# Altium project stm32f7board.PrjPcb (part 1 of 3)
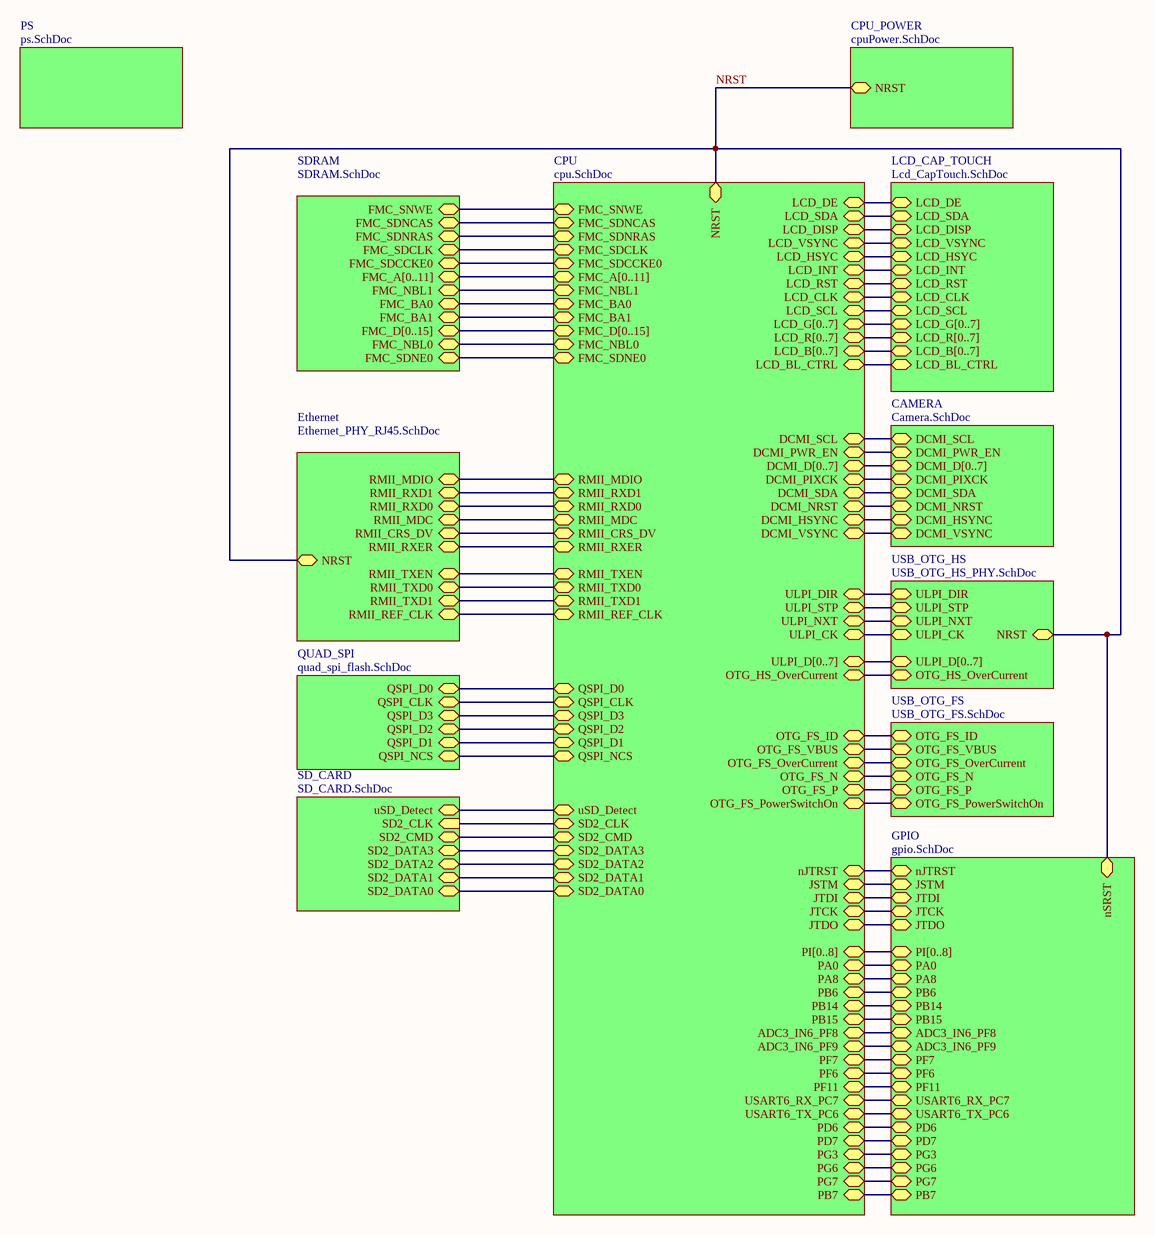
[diagram p0: main.SchDoc]
13 sheets, 223 parts. Net scope: hierarchical (ports join the sheet entries above them; power ports are global).
Board file: stm32f7ng.PcbDoc
Sheets:
  main.SchDoc
    CPU = cpu.SchDoc
    PS = ps.SchDoc
    Ethernet = Ethernet_PHY_RJ45.SchDoc
    SDRAM = SDRAM.SchDoc
    QUAD_SPI = quad_spi_flash.SchDoc
    CPU_POWER = cpuPower.SchDoc
    LCD_CAP_TOUCH = Lcd_CapTouch.SchDoc
    SD_CARD = SD_CARD.SchDoc
    CAMERA = Camera.SchDoc
    USB_OTG_FS = USB_OTG_FS.SchDoc
    USB_OTG_HS = USB_OTG_HS_PHY.SchDoc
    GPIO = gpio.SchDoc

## Sheet main.SchDoc
size B

### Sub-sheets
CAMERA = Camera.SchDoc: DCMI_SCL (bidir), DCMI_PWR_EN (bidir), DCMI_D[0..7] (bidir), DCMI_PIXCK (bidir), DCMI_SDA (bidir), DCMI_NRST (bidir), DCMI_HSYNC (bidir), DCMI_VSYNC (bidir)
CPU = cpu.SchDoc: FMC_SDNRAS (bidir), FMC_SNWE (bidir), FMC_NBL0 (bidir), FMC_SDCCKE0 (bidir), FMC_SDCLK (bidir), FMC_SDNCAS (bidir), FMC_SDNE0 (bidir), FMC_NBL1 (bidir), FMC_BA1 (bidir), FMC_BA0 (bidir), FMC_A[0..11] (bidir), FMC_D[0..15] (bidir), RMII_MDC (bidir), RMII_RXD0 (bidir), RMII_RXER (bidir), RMII_CRS_DV (bidir), RMII_RXD1 (bidir), RMII_MDIO (bidir), RMII_TXEN (bidir), RMII_TXD0 (bidir), RMII_TXD1 (bidir), RMII_REF_CLK (bidir), QSPI_D0 (bidir), QSPI_NCS (bidir), QSPI_D1 (bidir), QSPI_CLK (bidir), QSPI_D3 (bidir), QSPI_D2 (bidir), SD2_CLK (bidir), SD2_CMD (bidir), uSD_Detect (bidir), SD2_DATA3 (bidir), SD2_DATA2 (bidir), SD2_DATA1 (bidir), SD2_DATA0 (bidir), LCD_B[0..7] (bidir), LCD_VSYNC (bidir), LCD_DE (bidir), LCD_R[0..7] (bidir), LCD_G[0..7] (bidir), LCD_DISP (bidir), LCD_RST (bidir), LCD_SCL (bidir), LCD_SDA (bidir), LCD_INT (bidir), LCD_CLK (bidir), LCD_HSYC (bidir), LCD_BL_CTRL (bidir), DCMI_SCL (bidir), DCMI_NRST (bidir), DCMI_PWR_EN (bidir), DCMI_SDA (bidir), DCMI_VSYNC (bidir), DCMI_HSYNC (bidir), DCMI_PIXCK (bidir), DCMI_D[0..7] (bidir), ULPI_CK (bidir), ULPI_NXT (bidir), OTG_HS_OverCurrent (bidir), ULPI_D[0..7] (bidir), ULPI_DIR (bidir), ULPI_STP (bidir), OTG_FS_P (bidir), OTG_FS_VBUS (bidir), OTG_FS_OverCurrent (bidir), OTG_FS_PowerSwitchOn (bidir), OTG_FS_N (bidir), OTG_FS_ID (bidir), NRST (bidir), PA8 (bidir), PF7 (bidir), ADC3_IN6_PF8 (bidir), USART6_RX_PC7 (bidir), USART6_TX_PC6 (bidir), PD6 (bidir), PD7 (bidir), PB14 (bidir), PB15 (bidir), PB6 (bidir), PI[0..8] (bidir), PG3 (bidir), PG6 (bidir), PG7 (bidir), PF6 (bidir), PF11 (bidir), ADC3_IN6_PF9 (bidir), PA0 (bidir), JTCK (bidir), JSTM (bidir), JTDO (bidir), nJTRST (bidir), JTDI (bidir), PB7 (bidir)
CPU_POWER = cpuPower.SchDoc: NRST (bidir)
Ethernet = Ethernet_PHY_RJ45.SchDoc: RMII_MDIO (bidir), RMII_RXD1 (bidir), RMII_RXD0 (bidir), RMII_MDC (bidir), RMII_CRS_DV (bidir), RMII_RXER (bidir), NRST (bidir), RMII_TXEN (bidir), RMII_TXD0 (bidir), RMII_TXD1 (bidir), RMII_REF_CLK (bidir)
GPIO = gpio.SchDoc: PG3 (bidir), PF11 (bidir), USART6_RX_PC7 (bidir), PF6 (bidir), PG7 (bidir), ADC3_IN6_PF8 (bidir), JTDI (bidir), nJTRST (bidir), JSTM (bidir), PD7 (bidir), PB15 (bidir), PF7 (bidir), PB14 (bidir), PI[0..8] (bidir), USART6_TX_PC6 (bidir), PB6 (bidir), JTCK (bidir), PA0 (bidir), PG6 (bidir), PD6 (bidir), ADC3_IN6_PF9 (bidir), JTDO (bidir), PA8 (bidir), nSRST (bidir), PB7 (bidir)
LCD_CAP_TOUCH = Lcd_CapTouch.SchDoc: LCD_B[0..7] (bidir), LCD_DE (bidir), LCD_SDA (bidir), LCD_DISP (bidir), LCD_R[0..7] (bidir), LCD_SCL (bidir), LCD_INT (bidir), LCD_RST (bidir), LCD_HSYC (bidir), LCD_CLK (bidir), LCD_VSYNC (bidir), LCD_G[0..7] (bidir), LCD_BL_CTRL (bidir)
PS = ps.SchDoc: no entries
QUAD_SPI = quad_spi_flash.SchDoc: QSPI_D0 (bidir), QSPI_CLK (bidir), QSPI_D3 (bidir), QSPI_D2 (bidir), QSPI_D1 (bidir), QSPI_NCS (bidir)
SD_CARD = SD_CARD.SchDoc: uSD_Detect (bidir), SD2_CLK (in), SD2_CMD (bidir), SD2_DATA3 (bidir), SD2_DATA2 (bidir), SD2_DATA1 (bidir), SD2_DATA0 (bidir)
SDRAM = SDRAM.SchDoc: FMC_SNWE (bidir), FMC_SDNCAS (bidir), FMC_SDNRAS (bidir), FMC_SDCLK (bidir), FMC_SDCCKE0 (bidir), FMC_A[0..11] (bidir), FMC_NBL1 (bidir), FMC_BA0 (bidir), FMC_BA1 (bidir), FMC_D[0..15] (bidir), FMC_NBL0 (bidir), FMC_SDNE0 (bidir)
USB_OTG_FS = USB_OTG_FS.SchDoc: OTG_FS_ID (bidir), OTG_FS_VBUS (bidir), OTG_FS_OverCurrent (bidir), OTG_FS_N (bidir), OTG_FS_P (bidir), OTG_FS_PowerSwitchOn (bidir)
USB_OTG_HS = USB_OTG_HS_PHY.SchDoc: ULPI_DIR (bidir), ULPI_STP (bidir), ULPI_NXT (bidir), ULPI_CK (bidir), NRST (bidir), ULPI_D[0..7] (bidir), OTG_HS_OverCurrent (bidir)

### Nets
ADC3_IN6_PF8: sheet CPU/ADC3_IN6_PF8, sheet GPIO/ADC3_IN6_PF8
ADC3_IN7_PF9: sheet CPU/ADC3_IN6_PF9, sheet GPIO/ADC3_IN6_PF9
DCMI_HSYNC: sheet CPU/DCMI_HSYNC, sheet CAMERA/DCMI_HSYNC
DCMI_PIXCK: sheet CPU/DCMI_PIXCK, sheet CAMERA/DCMI_PIXCK
DCMI_PWR_EN: sheet CPU/DCMI_PWR_EN, sheet CAMERA/DCMI_PWR_EN
DCMI_SCL: sheet CPU/DCMI_SCL, sheet CAMERA/DCMI_SCL
DCMI_SDA: sheet CPU/DCMI_SDA, sheet CAMERA/DCMI_SDA
DCMI_VSYNC: sheet CPU/DCMI_VSYNC, sheet CAMERA/DCMI_VSYNC
FMC_BA0: sheet CPU/FMC_BA0, sheet SDRAM/FMC_BA0
FMC_BA1: sheet CPU/FMC_BA1, sheet SDRAM/FMC_BA1
FMC_NBL0: sheet CPU/FMC_NBL0, sheet SDRAM/FMC_NBL0
FMC_NBL1: sheet CPU/FMC_NBL1, sheet SDRAM/FMC_NBL1
FMC_SDCKE0: sheet CPU/FMC_SDCCKE0, sheet SDRAM/FMC_SDCCKE0
FMC_SDCLK: sheet CPU/FMC_SDCLK, sheet SDRAM/FMC_SDCLK
FMC_SDNCAS: sheet CPU/FMC_SDNCAS, sheet SDRAM/FMC_SDNCAS
FMC_SDNE0: sheet CPU/FMC_SDNE0, sheet SDRAM/FMC_SDNE0
FMC_SDNRAS: sheet CPU/FMC_SDNRAS, sheet SDRAM/FMC_SDNRAS
FMC_SDNWE: sheet CPU/FMC_SNWE, sheet SDRAM/FMC_SNWE
JSTM_SWDIO: sheet CPU/JSTM, sheet GPIO/JSTM
JTCK_SWCLK: sheet CPU/JTCK, sheet GPIO/JTCK
JTDI: sheet CPU/JTDI, sheet GPIO/JTDI
JTDO_SWO: sheet CPU/JTDO, sheet GPIO/JTDO
LCD_BL_CTRL: sheet CPU/LCD_BL_CTRL, sheet LCD_CAP_TOUCH/LCD_BL_CTRL
LCD_CLK: sheet CPU/LCD_CLK, sheet LCD_CAP_TOUCH/LCD_CLK
LCD_DE: sheet CPU/LCD_DE, sheet LCD_CAP_TOUCH/LCD_DE
LCD_DISP: sheet CPU/LCD_DISP, sheet LCD_CAP_TOUCH/LCD_DISP
LCD_HSYNC: sheet CPU/LCD_HSYC, sheet LCD_CAP_TOUCH/LCD_HSYC
LCD_INT: sheet CPU/LCD_INT, sheet LCD_CAP_TOUCH/LCD_INT
LCD_SCL: sheet CPU/LCD_SCL, sheet LCD_CAP_TOUCH/LCD_SCL
LCD_SDA: sheet CPU/LCD_SDA, sheet LCD_CAP_TOUCH/LCD_SDA
LCD_VSYNC: sheet CPU/LCD_VSYNC, sheet LCD_CAP_TOUCH/LCD_VSYNC
nJTRST: sheet CPU/nJTRST, sheet GPIO/nJTRST
NRST: sheet CPU/LCD_RST, sheet CPU/DCMI_NRST, sheet CPU/NRST, sheet Ethernet/NRST, sheet CPU_POWER/NRST, sheet LCD_CAP_TOUCH/LCD_RST, sheet CAMERA/DCMI_NRST, sheet USB_OTG_HS/NRST, sheet GPIO/nSRST  [project net DCMI_NRST]
OTG_FS_ID: sheet CPU/OTG_FS_ID, sheet USB_OTG_FS/OTG_FS_ID
OTG_FS_N: sheet CPU/OTG_FS_N, sheet USB_OTG_FS/OTG_FS_N
OTG_FS_OverCurrent: sheet CPU/OTG_FS_PowerSwitchOn, sheet USB_OTG_FS/OTG_FS_PowerSwitchOn
OTG_FS_P: sheet CPU/OTG_FS_P, sheet USB_OTG_FS/OTG_FS_P
OTG_FS_PowerSwitchOn: sheet CPU/OTG_FS_OverCurrent, sheet USB_OTG_FS/OTG_FS_OverCurrent
OTG_FS_VBUS: sheet CPU/OTG_FS_VBUS, sheet USB_OTG_FS/OTG_FS_VBUS
OTG_HS_OverCurrent: sheet CPU/OTG_HS_OverCurrent, sheet USB_OTG_HS/OTG_HS_OverCurrent
PA0: sheet CPU/PA0, sheet GPIO/PA0
PA8: sheet CPU/PA8, sheet GPIO/PA8
PB6: sheet CPU/QSPI_NCS, sheet CPU/PB6, sheet QUAD_SPI/QSPI_NCS, sheet GPIO/PB6
PB7: sheet CPU/PB7, sheet GPIO/PB7
PB14: sheet CPU/PB14, sheet GPIO/PB14
PB15: sheet CPU/PB15, sheet GPIO/PB15
PD6: sheet CPU/PD6, sheet GPIO/PD6
PD7: sheet CPU/PD7, sheet GPIO/PD7
PF6: sheet CPU/PF6, sheet GPIO/PF6
PF7: sheet CPU/PF7, sheet GPIO/PF7
PF11: sheet CPU/PF11, sheet GPIO/PF11
PG3: sheet CPU/PG3, sheet GPIO/PG3
PG6: sheet CPU/PG6, sheet GPIO/PG6
PG7: sheet CPU/PG7, sheet GPIO/PG7
QSPI_CLK: sheet CPU/QSPI_CLK, sheet QUAD_SPI/QSPI_CLK
QSPI_D0: sheet CPU/QSPI_D0, sheet QUAD_SPI/QSPI_D0
QSPI_D1: sheet CPU/QSPI_D1, sheet QUAD_SPI/QSPI_D1
QSPI_D2: sheet CPU/QSPI_D2, sheet QUAD_SPI/QSPI_D2
QSPI_D3: sheet CPU/QSPI_D3, sheet QUAD_SPI/QSPI_D3
RMII_CRS_DV: sheet CPU/RMII_CRS_DV, sheet Ethernet/RMII_CRS_DV
RMII_MDC: sheet CPU/RMII_MDC, sheet Ethernet/RMII_MDC
RMII_MDIO: sheet CPU/RMII_MDIO, sheet Ethernet/RMII_MDIO
RMII_REF_CLK: sheet CPU/RMII_REF_CLK, sheet Ethernet/RMII_REF_CLK
RMII_RXD0: sheet CPU/RMII_RXD0, sheet Ethernet/RMII_RXD0
RMII_RXD1: sheet CPU/RMII_RXD1, sheet Ethernet/RMII_RXD1
RMII_RXER: sheet CPU/RMII_RXER, sheet Ethernet/RMII_RXER
RMII_TXD0: sheet CPU/RMII_TXD0, sheet Ethernet/RMII_TXD0
RMII_TXD1: sheet CPU/RMII_TXD1, sheet Ethernet/RMII_TXD1
RMII_TXEN: sheet CPU/RMII_TXEN, sheet Ethernet/RMII_TXEN
ULPI_CK: sheet CPU/ULPI_CK, sheet USB_OTG_HS/ULPI_CK
ULPI_DIR: sheet CPU/ULPI_DIR, sheet USB_OTG_HS/ULPI_DIR
ULPI_NXT: sheet CPU/ULPI_NXT, sheet USB_OTG_HS/ULPI_NXT
ULPI_STP: sheet CPU/ULPI_STP, sheet USB_OTG_HS/ULPI_STP
USART6_RX_PC7: sheet CPU/USART6_RX_PC7, sheet GPIO/USART6_RX_PC7
USART6_TX_PC6: sheet CPU/USART6_TX_PC6, sheet GPIO/USART6_TX_PC6
uSD_CLK: sheet CPU/SD2_CLK, sheet SD_CARD/SD2_CLK
uSD_CMD: sheet CPU/SD2_CMD, sheet SD_CARD/SD2_CMD
uSD_D0: sheet CPU/SD2_DATA0, sheet SD_CARD/SD2_DATA0
uSD_D1: sheet CPU/SD2_DATA1, sheet SD_CARD/SD2_DATA1
uSD_D2: sheet CPU/SD2_DATA2, sheet SD_CARD/SD2_DATA2
uSD_D3: sheet CPU/SD2_DATA3, sheet SD_CARD/SD2_DATA3
uSD_Detect: sheet CPU/uSD_Detect, sheet SD_CARD/uSD_Detect

### Buses and harness runs
bus sheet CAMERA/DCMI_D[0..7] = sheet CPU/DCMI_D[0..7]
bus sheet CPU/FMC_A[0..11] = sheet SDRAM/FMC_A[0..11]
bus sheet CPU/FMC_D[0..15] = sheet SDRAM/FMC_D[0..15]
bus sheet CPU/LCD_B[0..7] = sheet LCD_CAP_TOUCH/LCD_B[0..7]
bus sheet CPU/LCD_G[0..7] = sheet LCD_CAP_TOUCH/LCD_G[0..7]
bus sheet CPU/LCD_R[0..7] = sheet LCD_CAP_TOUCH/LCD_R[0..7]
bus sheet CPU/PI[0..8] = sheet GPIO/PI[0..8]
bus sheet CPU/ULPI_D[0..7] = sheet USB_OTG_HS/ULPI_D[0..7]

## Sheet cpu.SchDoc
size B
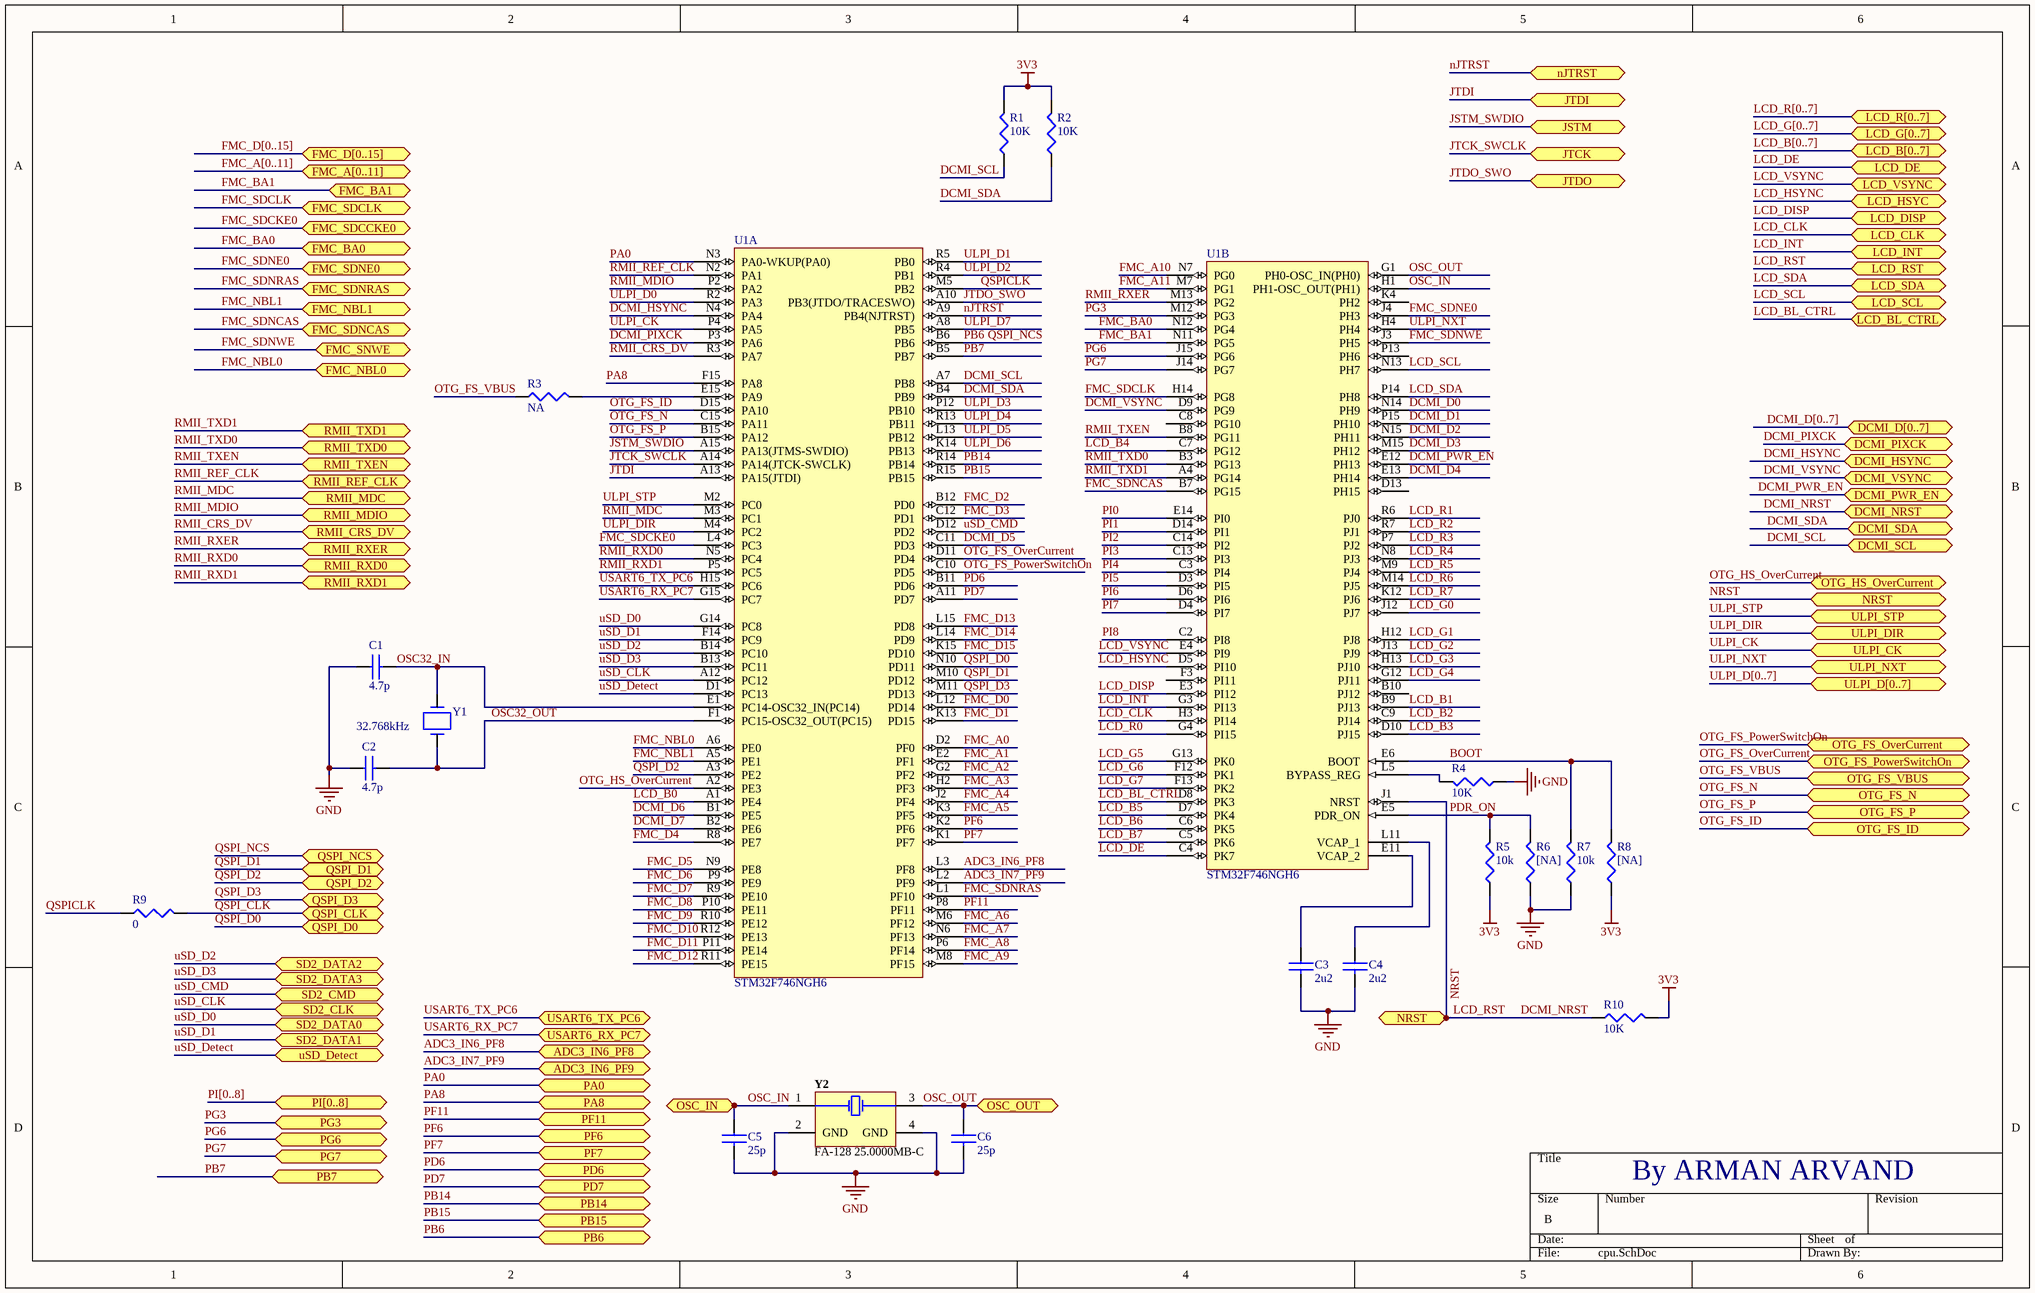
[diagram p1: cpu.SchDoc]

### Parts
C1  4.7p  [C0402]
C2  4.7p  [C0402]
C3  2u2  [C0402]
C4  2u2  [C0402]
C5  25p  [C0402]
C6  25p  [C0402]
R1  10K  [R0402]
R2  10K  [R0402]
R3  NA  [R0402]
R4  10K  [R0402]
R5  10k  [R0402]
R6  [NA]  [R0402]
R7  10k  [R0402]
R8  [NA]  [R0402]
R9  0  [R0402]
R10  10K  [R0402]
U1  STM32F746NGH6  [STM-TFBGA216]  (parts A,B of 3)
Y1  32.768kHz  [ABS06]
Y2  FA-128 25.0000MB-C  [EPSON-FA-128_V]

### Ports
ADC3_IN6_PF8 (bidir), ADC3_IN6_PF9 (bidir), DCMI_D[0..7] (bidir), DCMI_HSYNC (bidir), DCMI_NRST (bidir), DCMI_PIXCK (bidir), DCMI_PWR_EN (bidir), DCMI_SCL (bidir), DCMI_SDA (bidir), DCMI_VSYNC (bidir), FMC_A[0..11] (bidir), FMC_BA0 (bidir), FMC_BA1 (bidir), FMC_D[0..15] (bidir), FMC_NBL0 (bidir), FMC_NBL1 (bidir), FMC_SDCCKE0 (bidir), FMC_SDCLK (bidir), FMC_SDNCAS (bidir), FMC_SDNE0 (bidir), FMC_SDNRAS (bidir), FMC_SNWE (bidir), JSTM (bidir), JTCK (bidir), JTDI (bidir), JTDO (bidir), LCD_B[0..7] (bidir), LCD_BL_CTRL (bidir), LCD_CLK (bidir), LCD_DE (bidir), LCD_DISP (bidir), LCD_G[0..7] (bidir), LCD_HSYC (bidir), LCD_INT (bidir), LCD_R[0..7] (bidir), LCD_RST (bidir), LCD_SCL (bidir), LCD_SDA (bidir), LCD_VSYNC (bidir), nJTRST (bidir), NRST (bidir), OSC_IN (bidir), OSC_OUT (bidir), OTG_FS_ID (bidir), OTG_FS_N (bidir), OTG_FS_OverCurrent (bidir), OTG_FS_P (bidir), OTG_FS_PowerSwitchOn (bidir), OTG_FS_VBUS (bidir), OTG_HS_OverCurrent (bidir), PA0 (bidir), PA8 (bidir), PB6 (bidir), PB7 (bidir), PB14 (bidir), PB15 (bidir), PD6 (bidir), PD7 (bidir), PF6 (bidir), PF7 (bidir), PF11 (bidir), PG3 (bidir), PG6 (bidir), PG7 (bidir), PI[0..8] (bidir), QSPI_CLK (bidir), QSPI_D0 (bidir), QSPI_D1 (bidir), QSPI_D2 (bidir), QSPI_D3 (bidir), QSPI_NCS (bidir), RMII_CRS_DV (bidir), RMII_MDC (bidir), RMII_MDIO (bidir), RMII_REF_CLK (bidir), RMII_RXD0 (bidir), RMII_RXD1 (bidir), RMII_RXER (bidir), RMII_TXD0 (bidir), RMII_TXD1 (bidir), RMII_TXEN (bidir), SD2_CLK (bidir), SD2_CMD (bidir), SD2_DATA0 (bidir), SD2_DATA1 (bidir), SD2_DATA2 (bidir), SD2_DATA3 (bidir), ULPI_CK (bidir), ULPI_D[0..7] (bidir), ULPI_DIR (bidir), ULPI_NXT (bidir), ULPI_STP (bidir), USART6_RX_PC7 (bidir), USART6_TX_PC6 (bidir), uSD_Detect (bidir)

### Nets
3V3: R1.2 R2.2 R5.1 R8.1 R10.2
GND: C1.1 C2.1 C3.2 C4.2 C5.2 C6.2 R4.1 R6.1 R7.1 Y2.2(GND) Y2.4(GND)
ADC3_IN6_PF8: U1.L3(PF8) ; port ADC3_IN6_PF8
ADC3_IN7_PF9: U1.L2(PF9) ; port ADC3_IN6_PF9
BOOT: R7.2 R8.2 U1.E6(BOOT)
DCMI_D0: U1.N14(PH9)
DCMI_D1: U1.P15(PH10)
DCMI_D2: U1.N15(PH11)
DCMI_D3: U1.M15(PH12)
DCMI_D4: U1.E13(PH14)
DCMI_D5: U1.C11(PD3)
DCMI_D6: U1.B1(PE5)
DCMI_D7: U1.B2(PE6)
DCMI_HSYNC: U1.N4(PA4) ; port DCMI_HSYNC
DCMI_NRST: R10.1 U1.J1(NRST) ; port LCD_RST, port DCMI_NRST, port NRST  [also labelled LCD_RST, NRST]
DCMI_PIXCK: U1.P3(PA6) ; port DCMI_PIXCK
DCMI_PWR_EN: U1.E12(PH13) ; port DCMI_PWR_EN
DCMI_SCL: R1.1 U1.A7(PB8) ; port DCMI_SCL
DCMI_SDA: R2.1 U1.B4(PB9) ; port DCMI_SDA
DCMI_VSYNC: U1.D9(PG9) ; port DCMI_VSYNC
FMC_A0: U1.D2(PF0)
FMC_A1: U1.E2(PF1)
FMC_A2: U1.G2(PF2)
FMC_A3: U1.H2(PF3)
FMC_A4: U1.J2(PF4)
FMC_A5: U1.K3(PF5)
FMC_A6: U1.M6(PF12)
FMC_A7: U1.N6(PF13)
FMC_A8: U1.P6(PF14)
FMC_A9: U1.M8(PF15)
FMC_A10: U1.N7(PG0)
FMC_A11: U1.M7(PG1)
FMC_BA0: U1.N12(PG4) ; port FMC_BA0
FMC_BA1: U1.N11(PG5) ; port FMC_BA1
FMC_D0: U1.L12(PD14)
FMC_D1: U1.K13(PD15)
FMC_D2: U1.B12(PD0)
FMC_D3: U1.C12(PD1)
FMC_D4: U1.R8(PE7)
FMC_D5: U1.N9(PE8)
FMC_D6: U1.P9(PE9)
FMC_D7: U1.R9(PE10)
FMC_D8: U1.P10(PE11)
FMC_D9: U1.R10(PE12)
FMC_D10: U1.R12(PE13)
FMC_D11: U1.P11(PE14)
FMC_D12: U1.R11(PE15)
FMC_D13: U1.L15(PD8)
FMC_D14: U1.L14(PD9)
FMC_D15: U1.K15(PD10)
FMC_NBL0: U1.A6(PE0) ; port FMC_NBL0
FMC_NBL1: U1.A5(PE1) ; port FMC_NBL1
FMC_SDCKE0: U1.L4(PC3) ; port FMC_SDCCKE0
FMC_SDCLK: U1.H14(PG8) ; port FMC_SDCLK
FMC_SDNCAS: U1.B7(PG15) ; port FMC_SDNCAS
FMC_SDNE0: U1.J4(PH3) ; port FMC_SDNE0
FMC_SDNRAS: U1.L1(PF10) ; port FMC_SDNRAS
FMC_SDNWE: U1.J3(PH5) ; port FMC_SNWE
JSTM_SWDIO: U1.A15(PA13(JTMS-SWDIO)) ; port JSTM
JTCK_SWCLK: U1.A14(PA14(JTCK-SWCLK)) ; port JTCK
JTDI: U1.A13(PA15(JTDI)) ; port JTDI
JTDO_SWO: U1.A10(PB3(JTDO/TRACESWO)) ; port JTDO
LCD_B0: U1.A1(PE4)
LCD_B1: U1.B9(PJ13)
LCD_B2: U1.C9(PJ14)
LCD_B3: U1.D10(PJ15)
LCD_B4: U1.C7(PG12)
LCD_B5: U1.D7(PK4)
LCD_B6: U1.C6(PK5)
LCD_B7: U1.C5(PK6)
LCD_BL_CTRL: U1.D8(PK3) ; port LCD_BL_CTRL
LCD_CLK: U1.H3(PI14) ; port LCD_CLK
LCD_DE: U1.C4(PK7) ; port LCD_DE
LCD_DISP: U1.E3(PI12) ; port LCD_DISP
LCD_G0: U1.J12(PJ7)
LCD_G1: U1.H12(PJ8)
LCD_G2: U1.J13(PJ9)
LCD_G3: U1.H13(PJ10)
LCD_G4: U1.G12(PJ11)
LCD_G5: U1.G13(PK0)
LCD_G6: U1.F12(PK1)
LCD_G7: U1.F13(PK2)
LCD_HSYNC: U1.D5(PI10) ; port LCD_HSYC
LCD_INT: U1.G3(PI13) ; port LCD_INT
LCD_R0: U1.G4(PI15)
LCD_R1: U1.R6(PJ0)
LCD_R2: U1.R7(PJ1)
LCD_R3: U1.P7(PJ2)
LCD_R4: U1.N8(PJ3)
LCD_R5: U1.M9(PJ4)
LCD_R6: U1.M14(PJ5)
LCD_R7: U1.K12(PJ6)
LCD_SCL: U1.N13(PH7) ; port LCD_SCL
LCD_SDA: U1.P14(PH8) ; port LCD_SDA
LCD_VSYNC: U1.E4(PI9) ; port LCD_VSYNC
nJTRST: U1.A9(PB4(NJTRST)) ; port nJTRST
OSC32_IN: C1.2 U1.E1(PC14-OSC32_IN(PC14)) Y1.2
OSC32_OUT: C2.2 U1.F1(PC15-OSC32_OUT(PC15)) Y1.1
OSC_IN: C5.1 U1.H1(PH1-OSC_OUT(PH1)) Y2.1(X1) ; port OSC_IN
OSC_OUT: C6.1 U1.G1(PH0-OSC_IN(PH0)) Y2.3(X2) ; port OSC_OUT
OTG_FS_ID: U1.D15(PA10) ; port OTG_FS_ID
OTG_FS_N: U1.C15(PA11) ; port OTG_FS_N
OTG_FS_OverCurrent: U1.D11(PD4) ; port OTG_FS_PowerSwitchOn
OTG_FS_P: U1.B15(PA12) ; port OTG_FS_P
OTG_FS_PowerSwitchOn: U1.C10(PD5) ; port OTG_FS_OverCurrent
OTG_FS_VBUS: R3.1 ; port OTG_FS_VBUS
OTG_HS_OverCurrent: U1.A2(PE3) ; port OTG_HS_OverCurrent
PA0: U1.N3(PA0-WKUP(PA0)) ; port PA0
PA8: U1.F15(PA8) ; port PA8
PB6: U1.B6(PB6) ; port QSPI_NCS, port PB6  [also labelled QSPI_NCS]
PB7: U1.B5(PB7) ; port PB7
PB14: U1.R14(PB14) ; port PB14
PB15: U1.R15(PB15) ; port PB15
PD6: U1.B11(PD6) ; port PD6
PD7: U1.A11(PD7) ; port PD7
PDR_ON: R5.2 R6.2 U1.E5(PDR_ON)
PF6: U1.K2(PF6) ; port PF6
PF7: U1.K1(PF7) ; port PF7
PF11: U1.P8(PF11) ; port PF11
PG3: U1.M12(PG3) ; port PG3
PG6: U1.J15(PG6) ; port PG6
PG7: U1.J14(PG7) ; port PG7
PI0: U1.E14(PI0)
PI1: U1.D14(PI1)
PI2: U1.C14(PI2)
PI3: U1.C13(PI3)
PI4: U1.C3(PI4)
PI5: U1.D3(PI5)
PI6: U1.D6(PI6)
PI7: U1.D4(PI7)
PI8: U1.C2(PI8)
QSPI_CLK: R9.2 ; port QSPI_CLK
QSPI_D0: U1.N10(PD11) ; port QSPI_D0
QSPI_D1: U1.M10(PD12) ; port QSPI_D1
QSPI_D2: U1.A3(PE2) ; port QSPI_D2
QSPI_D3: U1.M11(PD13) ; port QSPI_D3
QSPICLK: R9.1 U1.M5(PB2)
RMII_CRS_DV: U1.R3(PA7) ; port RMII_CRS_DV
RMII_MDC: U1.M3(PC1) ; port RMII_MDC
RMII_MDIO: U1.P2(PA2) ; port RMII_MDIO
RMII_REF_CLK: U1.N2(PA1) ; port RMII_REF_CLK
RMII_RXD0: U1.N5(PC4) ; port RMII_RXD0
RMII_RXD1: U1.P5(PC5) ; port RMII_RXD1
RMII_RXER: U1.M13(PG2) ; port RMII_RXER
RMII_TXD0: U1.B3(PG13) ; port RMII_TXD0
RMII_TXD1: U1.A4(PG14) ; port RMII_TXD1
RMII_TXEN: U1.B8(PG11) ; port RMII_TXEN
ULPI_CK: U1.P4(PA5) ; port ULPI_CK
ULPI_D0: U1.R2(PA3)
ULPI_D1: U1.R5(PB0)
ULPI_D2: U1.R4(PB1)
ULPI_D3: U1.P12(PB10)
ULPI_D4: U1.R13(PB11)
ULPI_D5: U1.L13(PB12)
ULPI_D6: U1.K14(PB13)
ULPI_D7: U1.A8(PB5)
ULPI_DIR: U1.M4(PC2) ; port ULPI_DIR
ULPI_NXT: U1.H4(PH4) ; port ULPI_NXT
ULPI_STP: U1.M2(PC0) ; port ULPI_STP
USART6_RX_PC7: U1.G15(PC7) ; port USART6_RX_PC7
USART6_TX_PC6: U1.H15(PC6) ; port USART6_TX_PC6
uSD_CLK: U1.A12(PC12) ; port SD2_CLK
uSD_CMD: U1.D12(PD2) ; port SD2_CMD
uSD_D0: U1.G14(PC8) ; port SD2_DATA0
uSD_D1: U1.F14(PC9) ; port SD2_DATA1
uSD_D2: U1.B14(PC10) ; port SD2_DATA2
uSD_D3: U1.B13(PC11) ; port SD2_DATA3
uSD_Detect: U1.D1(PC13) ; port uSD_Detect
NetC3_1: C3.1 U1.E11(VCAP_2)
NetC4_1: C4.1 U1.L11(VCAP_1)
NetR3_2: R3.2 U1.E15(PA9)
NetR4_2: R4.2 U1.L5(BYPASS_REG)

Not connected (* = marked no-connect by the designer): U1 B10(PJ12) C8(PG10) D13(PH15) F3(PI11) K4(PH2) P13(PH6)

### Buses and harness runs
bus DCMI_D[0..7] = port DCMI_D[0..7]
bus FMC_A[0..11] = port FMC_A[0..11]
bus FMC_D[0..15] = port FMC_D[0..15]
bus LCD_B[0..7] = port LCD_B[0..7]
bus LCD_G[0..7] = port LCD_G[0..7]
bus LCD_R[0..7] = port LCD_R[0..7]
bus PI[0..8] = port PI[0..8]
bus ULPI_D[0..7] = port ULPI_D[0..7]

### Notes on the sheet
- By ARMAN ARVAND

### Library data of the parts
C1 C2 C5 C6 = C1005C0G1H180J: CAP CER 18PF 50V C0G 5% 0402; Manufacturer: TDK Corporation; .Checked PCB: used; Temperature Coefficient: C0G, NP0; Capacitance: 18pF; Category: Capacitors; Supplier Part Number: 445-1238-1-ND; Manufacturer Part Number: C1005C0G1H180J; Operating Temperature: -55°C ~ 125°C; Package / Case: 0402 (1005 Metric); Price 1k [$]: 0.00468; Value: 18pF; .Checked SCH: used; Voltage - Rated: 50V; Supplier: Digikey; Supplier 1: Digi-Key; Supplier Part Number 1: 445-1238-1-ND; RoHS: RoHS Compliant; Stock 1: 24321; Pricing 1: 1=0.08, 10=0.05, 100=0.018, 250=0.013, 500=0.0096, 1000=0.0065 (USD); Tolerance: ±5%; Mounting Type: Surface Mount, MLCC; Applications: General Purpose; Ratings: -; Size / Dimension: 0.039" L x 0.020" W (1.00mm x 0.50mm); Height - Seated (Max): -; Thickness (Max): 0.022" (0.55mm); Lead Spacing: -; Features: -; Packaging: Cut Tape (CT); Lead Style: -; ComponentLink1URL: http://www.tdk.co.jp/tefe02/e412_c.pdf; ComponentLink1Description: http://www.tdk.co.jp/tefe02/e412_c.pdf
C3 C4 = C1005X5R1A225K: CAP CER 2.2UF 10V 10% X5R 0402; Manufacturer: TDK Corporation; Capacitance: 2.2µF; .Checked PCB: RF; Supplier 1: Digi-Key; Supplier Part Number 1: 445-7392-1-ND; Manufacturer Part Number: C1005X5R1A225K; RoHS: RoHS Compliant; Category: Capacitors; Stock 1: 22891; Pricing 1: 1=0.42, 10=0.332, 100=0.2, 250=0.15, 500=0.128, 1000=0.1 (USD); Voltage - Rated: 10V; Tolerance: ±10%; Temperature Coefficient: X5R; Mounting Type: Surface Mount, MLCC; Operating Temperature: -55°C ~ 85°C; Applications: General Purpose; Ratings: -; Package / Case: 0402 (1005 Metric); Size / Dimension: 0.039" L x 0.020" W (1.00mm x 0.50mm); Height - Seated (Max): -; Thickness (Max): 0.022" (0.55mm); Lead Spacing: -; Features: -; Packaging: Cut Tape (CT); Lead Style: -; ComponentLink1URL: http://www.tdk.com/pdf/general_B11.pdf; ComponentLink1Description: http://www.tdk.com/pdf/general_B11.pdf; .Checked SCH: RF
R1-R4 R9 R10 = RC0402FR-07100RL: RES 100 OHM 1/16W 1% 0402 SMD; Manufacturer: Yageo; Resistance (Ohms): 100; Power (Watts): 0.063W, 1/16W; Value: 100R; .Checked PCB: RF; Temperature Coefficient: ±100ppm/°C; Category: Resistors; Supplier Part Number: 311-100LRCT-ND; Manufacturer Part Number: RC0402FR-07100RL; Package / Case: 0402 (1005 Metric); Price 1k [$]: 0.01421; Tolerance: ±1%; .Checked SCH: RF; Supplier: Digikey; Supplier 1: Digi-Key; Supplier Part Number 1: 311-100LRCT-ND; RoHS: RoHS Compliant; Stock 1: 1682040; Pricing 1: 10=0.014, 50=0.0104, 100=0.0079, 250=0.00584, 500=0.00432, 1000=0.00288 (USD); Composition: Thick Film; Features: -; Size / Dimension: 0.039" L x 0.020" W (1.00mm x 0.50mm); Height: 0.016" (0.40mm); Number of Terminations: 2; Packaging: Cut Tape (CT); ComponentLink1URL: http://www.yageo.com/documents/recent/PYu-RC0402_51_RoHS_L_6.pdf; ComponentLink1Description: http://www.yageo.com/documents/recent/PYu-RC0402_51_RoHS_L_6.pdf
R5 R7 = RC0402FR-0710KL: RES 10.0K OHM 1/16W 1% 0402 SMD; Manufacturer: Yageo; Power (Watts): 0.063W, 1/16W; .Checked PCB: used; Temperature Coefficient: ±100ppm/°C; Category: Resistors; Supplier Part Number: 311-10.0KLRCT-ND; Manufacturer Part Number: RC0402FR-0710KL; Package / Case: 0402 (1005 Metric); Price 1k [$]: 0.01421; Resistance (Ohms): 10K; Tolerance: ±1%; Value: 10k; .Checked SCH: used; Supplier: Digikey; Supplier 1: Digi-Key; Supplier Part Number 1: 311-10.0KLRCT-ND; RoHS: RoHS Compliant; Stock 1: 2916495; Pricing 1: 10=0.014, 50=0.0104, 100=0.0079, 250=0.00584, 500=0.00432, 1000=0.00288 (USD); Composition: Thick Film; Features: -; Size / Dimension: 0.039" L x 0.020" W (1.00mm x 0.50mm); Height: 0.016" (0.40mm); Number of Terminations: 2; Packaging: Cut Tape (CT); ComponentLink1URL: http://www.yageo.com/documents/recent/PYu-RC0402_51_RoHS_L_6.pdf; ComponentLink1Description: http://www.yageo.com/documents/recent/PYu-RC0402_51_RoHS_L_6.pdf
R6 R8 = RC0402FR-0710KL: RES 10.0K OHM 1/16W 1% 0402 SMD; Manufacturer: Yageo; Resistance (Ohms): 10K; Power (Watts): 0.063W, 1/16W; Value: 10k; .Checked PCB: used; Temperature Coefficient: ±100ppm/°C; Category: Resistors; Supplier Part Number: 311-10.0KLRCT-ND; Manufacturer Part Number: RC0402FR-0710KL; Package / Case: 0402 (1005 Metric); Price 1k [$]: 0.01421; Tolerance: ±1%; .Checked SCH: used; Supplier: Digikey; Supplier 1: Digi-Key; Supplier Part Number 1: 311-10.0KLRCT-ND; RoHS: RoHS Compliant; Stock 1: 2916495; Pricing 1: 10=0.014, 50=0.0104, 100=0.0079, 250=0.00584, 500=0.00432, 1000=0.00288 (USD); Composition: Thick Film; Features: -; Size / Dimension: 0.039" L x 0.020" W (1.00mm x 0.50mm); Height: 0.016" (0.40mm); Number of Terminations: 2; Packaging: Cut Tape (CT); ComponentLink1URL: http://www.yageo.com/documents/recent/PYu-RC0402_51_RoHS_L_6.pdf; ComponentLink1Description: http://www.yageo.com/documents/recent/PYu-RC0402_51_RoHS_L_6.pdf
U1 = STM32F746NGH6: ARM-Based Cortex-M7 32 Bit MCU+FPU, 462 DMIPS, 1024 kB Flash, 320 kB RAM, 168 I/Os, -40 to 85 degC, 216-Pin TFBGA, Halogen-Free, Tray; L1 Cache Data Memory: 4 KByte; Program Memory Size: 1024 KByte; Supply Voltage Max: 3.6 V; Clock Frequency Max: 216 MHz; Supply Voltage Min: 1.7 V; Number of I/Os: 168; Data RAM Size: 320 KByte; Data Bus Width: 32 bit; Temperature Min: -40 degC; L1 Cache Instruction Memory: 4 KByte; PartNumber: STM32F746NG; ComponentLink1Description: Manufacturer URL; ComponentLink2Description: Datasheet; DatasheetVersion: Rev. 1; ComponentLink3URL: http://www.st.com/st-web-ui/static/active/en/resource/technical/document/data_brief/DM00053488.pdf; ComponentLink1URL: http://www.st.com/web/en/home.html; Packing: Tray; ComponentLink2URL: http://www.st.com/st-web-ui/static/active/en/resource/technical/document/datasheet/DM00166116.pdf; ComponentLink3Description: Package Specification; PackageVersion: Rev. 2, 05/2013; Mounting Technology: Surface Mount; PackageDescription: 216-Ball Ultra Thin Fine Pitch Ball Grid Array, 13 x 13 x 0.8 mm Body, 0.8 mm Pitch; Temperature Max: 85 degC
Y1 = ABS06-32.768KHZ-9-1-T: CRYSTAL 32.768 KHZ 9.0 PF SMD; Manufacturer: Abracon Corporation; .Checked PCB: used; Frequency Stability: ±10ppm; Load Capacitance: 9pF; Operating Mode: Fundamental; .Checked SCH: used; Category: Crystals and Oscillators; Manufacturer Part Number: ABS06-32.768KHZ-9-1-T; Operating Temperature: -40°C ~ 85°C; Package / Case: 2-SMD, No Lead (DFN, LCC); Price 1k [$]: 1.24500; Value: 32.768kHz; Frequency: 32.768kHz; Supplier Part Number: 535-10247-1-ND; Supplier: Digikey; Supplier 1: Digi-Key; Supplier Part Number 1: 535-10247-1-ND; RoHS: RoHS Compliant; Stock 1: 5693; Pricing 1: 1=2.81, 10=2.438, 50=2.1376, 100=1.6875, 500=1.425 (USD); Type: kHz Crystal (Tuning Fork); Frequency Tolerance: ±10ppm; Mounting Type: Surface Mount; Size / Dimension: 0.079" L x 0.047" W (2.00mm x 1.20mm); Height: 0.024" (0.60mm); Packaging: Cut Tape (CT); ComponentLink1URL: http://www.abracon.com/Resonators/ABS06.pdf; ComponentLink1Description: http://www.abracon.com/Resonators/ABS06.pdf
Y2 = CMP-1695-00001-3: Range Crystal Unit, 25 MHz, -40 to 85 degC, 4-Pin SMD, RoHS, Tape and Reel; ComponentLink2Description: Datasheet; Mounting Technology: Surface Mount; PackageDescription: 4-Pin Surface Mount Device, Body 1.6 x 2 mm, Pitch 1.45 mm; ComponentLink1URL: https://www.eea.epson.com/; DatasheetVersion: Rev. Feb-15; ComponentLink2URL: https://support.epson.biz/td/api/doc_check.php?dl=brief_FA-128_en.pdf; ComponentLink1Description: Manufacturer URL; PartNumber: FA-128 25.0000MB-C

## Sheet ps.SchDoc
size A
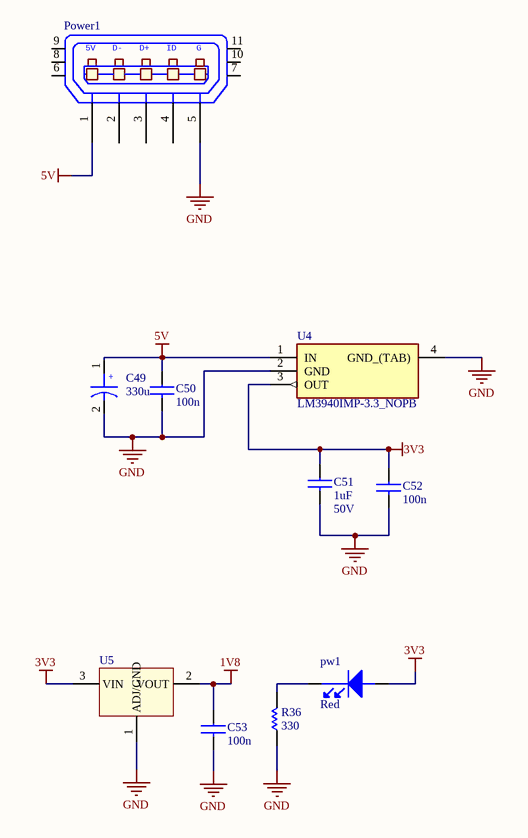
[diagram p2: ps.SchDoc]

### Parts
C49  330u  [C2917]
C50  100n  [C0402]
C51  1uF  Voltage - Rated: 50V  [C0805]
C52  100n  [C0402]
C53  100n  [C0402]
Power1  USB MICRO AB  [USB_Micro_AB]  (value not drawn)
pw1  Red  [LED_0603]
R36  330  [RES 1206]
U4  LM3940IMP-3.3_NOPB  [SOT230P700X180-4N]
U5  AMS1117  [AMS1117]  (value not drawn)

### Nets
1V8: C53.1 U5.2(VOUT)
3V3: C51.1 C52.1 pw1.2(ANODE) U4.3(OUT) U5.3(VIN)
5V: C49.1 C50.1 Power1.1(P1) U4.1(IN)
GND: C49.2 C50.2 C51.2 C52.2 C53.2 Power1.5(P5) R36.1 U4.2(GND) U4.4(GND_(TAB)) U5.1(ADJ/GND)
Netpw1_1: pw1.1(cathode) R36.2

Not connected (* = marked no-connect by the designer): Power1 2(P2) 3(P3) 4(P4) 6 7 8 9 10 11

### Notes on the sheet
- (in symbol 0475890001) 5V; D-; D+; ID; G
- (in symbol T495D337K010ATE150) +

### Library data of the parts
C49 = T495D337K010ATE150: CAP TANT 330UF 10V 10% 2917; Manufacturer: Kemet; Manufacturer Size Code: D; Capacitance: 330µF; ESR (Equivalent Series Resistance): 150 mOhm; Type: Molded; .Creator: MM; .Checked SCH: RF, used by MM; Supplier 1: Digi-Key; Manufacturer Part Number: T495D337K010ATE150; RoHS: RoHS Compliant; Category: Capacitors; Stock 1: 272; Pricing 1: 1=1.84, 10=1.455, 50=1.2612, 100=1.0915, 250=0.9702 (USD); Packaging: Cut Tape (CT); Voltage - Rated: 10V; Tolerance: ±10%; Operating Temperature: -55°C ~ 125°C; Mounting Type: Surface Mount; Package / Case: 2917 (7343 Metric); Size / Dimension: 0.287" L x 0.169" W (7.30mm x 4.30mm); Height - Seated (Max): 0.122" (3.10mm); Lead Spacing: -; Features: General Purpose; Lifetime @ Temp.: -; ComponentLink1URL: http://www.kemet.com/kemet/web/homepage/kechome.nsf/vapubfiles/KEM_T2009_T495.pdf/$file/KEM_T2009_T495.pdf; ComponentLink1Description: http://www.kemet.com/kemet/web/homepage/kechome.nsf/vapubfiles/KEM_T2009_T495.pdf/$file/KEM_T2009_T495.pdf; Supplier Part Number 1: 399-10511-1-ND; .Checked PCB: MM
C50 C52 C53 = C1005X5R1H104K: CAP CER .10UF 50V X5R 10% 0402; Manufacturer: TDK Corporation; Capacitance: 0.1µF; Value: 100nF; .Checked PCB: used; Category: Capacitors; Supplier Part Number: 445-5942-1-ND; Manufacturer Part Number: C1005X5R1H104K; Operating Temperature: -55°C ~ 85°C; Package / Case: 0402 (1005 Metric); Price 1k [$]: 0.02340; .Checked SCH: used; Voltage - Rated: 50V; Supplier: Digikey; Supplier 1: Digi-Key; Supplier Part Number 1: 445-5942-1-ND; RoHS: RoHS Compliant; Stock 1: 106926; Pricing 1: 1=0.27, 10=0.18, 100=0.072, 250=0.05176, 500=0.0369, 1000=0.027 (USD); Tolerance: ±10%; Temperature Coefficient: X5R; Mounting Type: Surface Mount, MLCC; Applications: General Purpose; Ratings: -; Size / Dimension: 0.039" L x 0.020" W (1.00mm x 0.50mm); Height - Seated (Max): -; Thickness (Max): 0.022" (0.55mm); Lead Spacing: -; Features: -; Packaging: Cut Tape (CT); Lead Style: -; ComponentLink1URL: http://www.tdk.co.jp/tefe02/e412_c.pdf; ComponentLink1Description: http://www.tdk.co.jp/tefe02/e412_c.pdf
C51 = GRM21BR71H105KA12L: CAP CER 1UF 50V X7R 0805; Manufacturer: Murata Electronics North America; Capacitance: 1.0µF; .Checked PCB: used; Tolerance: ±10%; Category: Capacitors; Manufacturer Part Number: GRM21BR71H105KA12L; Operating Temperature: -55°C ~ 125°C; Package / Case: 0805 (2012 Metric); Price 1k [$]: 0.1359; Value: 1uF; .Checked SCH: used; Supplier Part Number: 490-4736-1-ND; Supplier: Digikey; Supplier 1: Digi-Key; Supplier Part Number 1: 490-4736-1-ND; RoHS: RoHS Compliant; Stock 1: 422791; Pricing 1: 1=0.28, 10=0.254, 25=0.226, 50=0.1978, 100=0.1836, 250=0.16952, 500=0.16102, 750=0.14691, 1000=0.12995 (USD); Temperature Coefficient: X7R; Mounting Type: Surface Mount, MLCC; Applications: General Purpose; Ratings: -; Size / Dimension: 0.079" L x 0.049" W (2.00mm x 1.25mm); Height - Seated (Max): -; Thickness (Max): 0.053" (1.35mm); Lead Spacing: -; Features: -; Packaging: Cut Tape (CT); Lead Style: -; ComponentLink1URL: http://search.murata.co.jp/Ceramy/image/img/PDF/ENG/GRM21BR71H105KA12.pdf; ComponentLink1Description: http://search.murata.co.jp/Ceramy/image/img/PDF/ENG/GRM21BR71H105KA12.pdf
Power1 = 0475890001: CONN RCPT MICRO USB AB R/A SMD; Manufacturer: Molex Inc; Connector Type: USB - micro AB; Number of Contacts: 5; Gender: Receptacle; .Creator: MM; Supplier 1: Digi-Key; Manufacturer Part Number: 0475890001; RoHS: RoHS Compliant; Category: Connectors, Interconnects; Stock 1: 12754; Pricing 1: 1=0.81, 10=0.764, 25=0.6872, 50=0.6108, 100=0.5854, 250=0.53452, 500=0.50908 (USD); Packaging: Cut Tape (CT); Specifications: -; Mounting Type: Surface Mount, Right Angle, Horizontal; Features: Board Guide, Shielded; Ingress Protection: -; ComponentLink1URL: http://www.molex.com/pdm_docs/sd/475890001_sd.pdf; ComponentLink1Description: http://www.molex.com/pdm_docs/sd/475890001_sd.pdf; Supplier Part Number 1: WM17143CT-ND; .Checked PCB: MM; .Checked SCH: MM
pw1 = LS L29K-H1J2-1-Z: LED SMARTLED RED 630NM 0603 SMD; Manufacturer: OSRAM Opto Semiconductors Inc; Millicandela Rating: 4.95mcd; Voltage - Forward (Vf) Typ: 1.8V; Current - Test: 2mA; Wavelength - Peak: 643nm; Viewing Angle: 160°; Lens Type: Diffused; Lens Style/Size: Rectangle with Flat Top, 1.3mm x 0.8mm; Luminous Flux @ Current - Test: 20 mlm; .Checked PCB: RF; Supplier 1: Digi-Key; Supplier Part Number 1: 475-1195-1-ND; Manufacturer Part Number: LS L29K-H1J2-1-Z; RoHS: RoHS Compliant; Category: Optoelectronics; Stock 1: 71670; Pricing 1: 1=0.16, 10=0.137, 100=0.1093, 250=0.09564, 500=0.08744 (USD); Color: Red; Wavelength - Dominant: 630nm; Package / Case: 0603 (1608 Metric); Size / Dimension: 1.70mm L x 0.80mm W; Height: 0.65mm; Mounting Type: Surface Mount; Packaging: Cut Tape (CT); ComponentLink1URL: http://catalog.osram-os.com/catalogue/catalogue.do;jsessionid=DB7CFDBAC5AF1E216E45F622E867085A?act=downloadFile&favOid=020000010003f9de000100b6; ComponentLink1Description: http://catalog.osram-os.com/catalogue/catalogue.do;jsessionid=DB7CFDBAC5AF1E216E45F622E867085A?act=downloadFile&favOid=020000010003f9de000100b6; .Checked SCH: RF
R36 = RESISTOR: value: 330
U4 = LM3940IMP-3.3_NOPB: Integrated Circuit; Manufacturer_Name: Texas Instruments; Manufacturer_Part_Number: LM3940IMP-3.3/NOPB; Datasheet Link: http://www.ti.com/lit/ds/symlink/lm3940.pdf; Height: 1.8mm; Mouser Part Number: 926-LM3940IMP3.3NOPB; Mouser Price/Stock: https://www.mouser.com/Search/Refine.aspx?Keyword=926-LM3940IMP3.3NOPB; RS Part Number: 5361546P; RS Price/Stock: http://uk.rs-online.com/web/p/products/5361546P
U5 = AMS1117: SOT-223-3 3V3 Regulator

## Sheet Ethernet_PHY_RJ45.SchDoc
size A
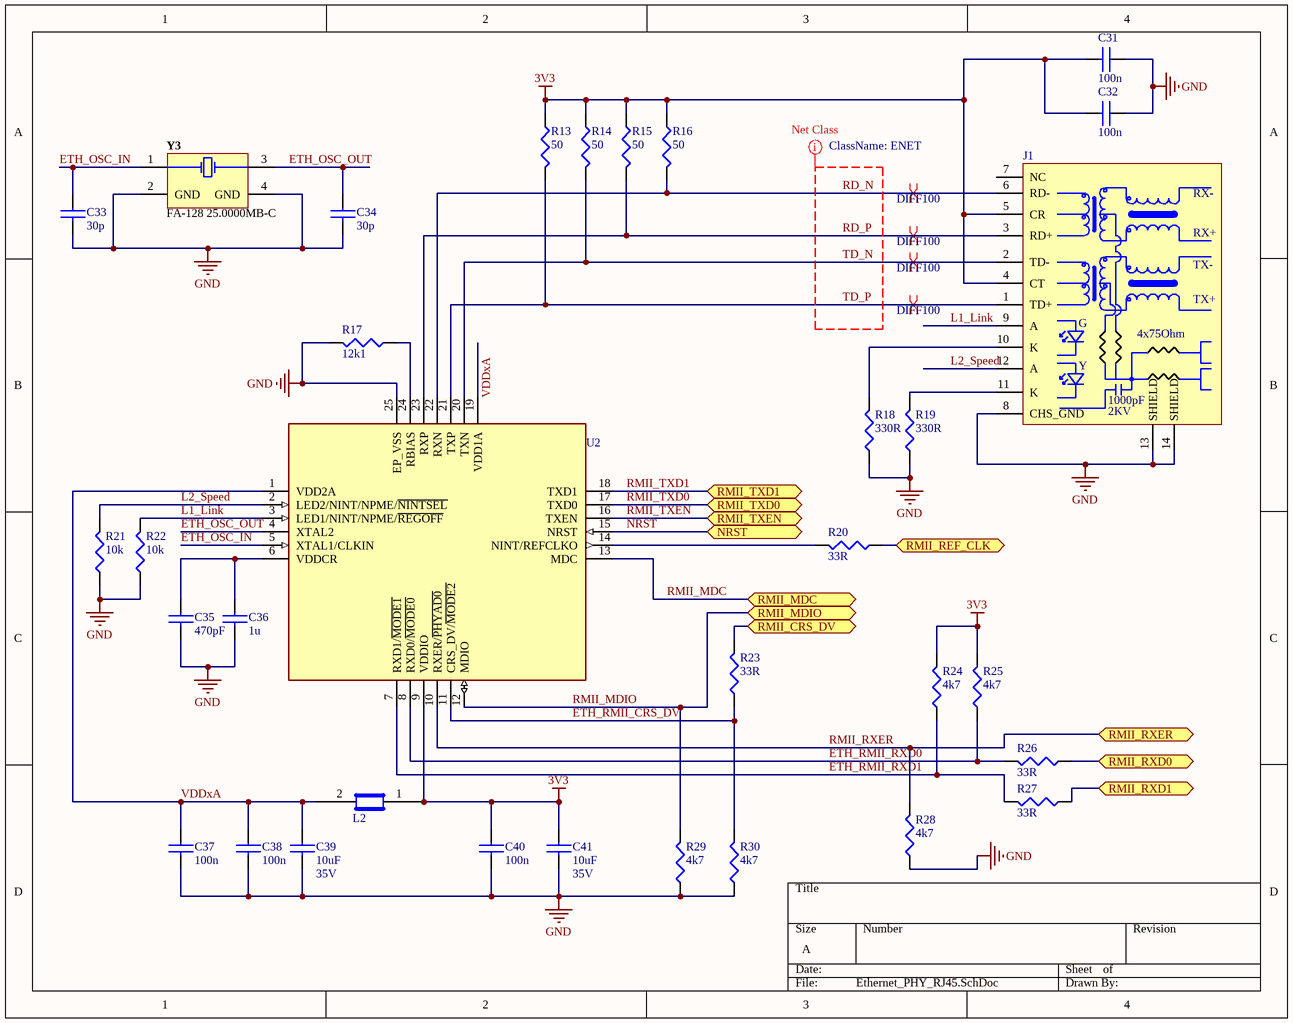
[diagram p3: Ethernet_PHY_RJ45.SchDoc]

### Parts
C31  100n  [C0402]
C32  100n  [C0402]
C33  30p  [C0402]
C34  30p  [C0402]
C35  470pF  [C0402]
C36  1u  [C0402]
C37  100n  [C0402]
C38  100n  [C0402]
C39  10uF  Voltage - Rated: 35V  [C1206]
C40  100n  [C0402]
C41  10uF  Voltage - Rated: 35V  [C1206]
J1  RJ45  [RJ45_HAN_RUN]  (value not drawn)
L2  MPZ1608S601A 600OHM/1A  [C0603]  (value not drawn)
R13  50  [R0402]
R14  50  [R0402]
R15  50  [R0402]
R16  50  [R0402]
R17  12k1  [R0402]
R18  330R  [R0402]
R19  330R  [R0402]
R20  33R  [R0402]
R21  10k  [R0402]
R22  10k  [R0402]
R23  33R  [R0402]
R24  4k7  [R0402]
R25  4k7  [R0402]
R26  33R  [R0402]
R27  33R  [R0402]
R28  4k7  [R0402]
R29  4k7  [R0402]
R30  4k7  [R0402]
U2  LAN8742A-CZ-TR  [QFN50P400X400X100-25N-D]  (value not drawn)
Y3  FA-128 25.0000MB-C  [EPSON-FA-128_V]

### Ports
NRST (bidir), RMII_CRS_DV (bidir), RMII_MDC (bidir), RMII_MDIO (bidir), RMII_REF_CLK (bidir), RMII_RXD0 (bidir), RMII_RXD1 (bidir), RMII_RXER (bidir), RMII_TXD0 (bidir), RMII_TXD1 (bidir), RMII_TXEN (bidir)

### Nets
3V3: C31.2 C32.2 C40.1 C41.1 J1.4(CT) J1.5(CR) L2.1 R13.1 R14.1 R15.1 R16.1 R24.2 R25.2 U2.9(VDDIO)
GND: C31.1 C32.1 C33.2 C34.2 C35.2 C36.2 C37.2 C38.2 C39.2 C40.2 C41.2 J1.8(CHS_GND) J1.13(SHIELD) J1.14(SHIELD) R17.2 R18.1 R19.1 R21.1 R22.1 R28.1 R29.1 R30.1 U2.25(EP_VSS) Y3.2(GND) Y3.4(GND)
ETH_OSC_IN: C33.1 U2.5(XTAL1/CLKIN) Y3.1(X1)
ETH_OSC_OUT: C34.1 U2.4(XTAL2) Y3.3(X2)
ETH_RMII_CRS_DV: R23.1 R30.2 U2.11(CRS_DV/~{MODE2})
ETH_RMII_RXD0: R25.1 R26.2 U2.8(RXD0/~{MODE0})
ETH_RMII_RXD1: R24.1 R27.2 U2.7(RXD1/~{MODE1})
L1_Link: J1.9(A) R22.2 U2.3(LED1/NINT/NPME/~{REGOFF})
L2_Speed: J1.12(A) R21.2 U2.2(LED2/NINT/NPME/~{NINTSEL})
NRST: U2.15(NRST) ; port NRST  [project net DCMI_NRST]
RD_N: J1.6(RD-) R16.2 U2.22(RXN)
RD_P: J1.3(RD+) R15.2 U2.23(RXP)
RMII_CRS_DV: R23.2 ; port RMII_CRS_DV
RMII_MDC: U2.13(MDC) ; port RMII_MDC
RMII_MDIO: R29.2 U2.12(MDIO) ; port RMII_MDIO
RMII_REF_CLK: R20.1 ; port RMII_REF_CLK
RMII_RXD0: R26.1 ; port RMII_RXD0
RMII_RXD1: R27.1 ; port RMII_RXD1
RMII_RXER: R28.2 U2.10(RXER/~{PHYAD0}) ; port RMII_RXER
RMII_TXD0: U2.17(TXD0) ; port RMII_TXD0
RMII_TXD1: U2.18(TXD1) ; port RMII_TXD1
RMII_TXEN: U2.16(TXEN) ; port RMII_TXEN
TD_N: J1.2(TD-) R14.2 U2.20(TXN)
TD_P: J1.1(TD+) R13.2 U2.21(TXP)
VDDxA: C37.1 C38.1 C39.1 L2.2 U2.1(VDD2A) U2.19(VDD1A)
NetC35_1: C35.1 C36.1 U2.6(VDDCR)
NetJ1_10: J1.10(K) R18.2
NetJ1_11: J1.11(K) R19.2
NetR17_1: R17.1 U2.24(RBIAS)
NetR20_2: R20.2 U2.14(NINT/REFCLKO)

Not connected (* = marked no-connect by the designer): J1 7(NC)

### Layout directives
differential pair; differential pair class DIFF100: RD_N, RD_P, TD_N, TD_P
net class ENET: RD_N, RD_P, TD_N, TD_P

### Notes on the sheet
- (in symbol HR911105A) RX-; RX+; TX-; TX+; G; 4x75Ohm; Y; 1000pF; 2KV

### Library data of the parts
C31 C32 C37 C38 C40 = C1005X5R1H104K: as C50 on sheet ps; Category: Capacitors; Supplier Part Number: 445-5942-1-ND; Manufacturer Part Number: C1005X5R1H104K; Operating Temperature: -55°C ~ 85°C; Package / Case: 0402 (1005 Metric); Price 1k [$]: 0.02340; .Checked SCH: used; Voltage - Rated: 50V; Supplier: Digikey; Supplier 1: Digi-Key; Supplier Part Number 1: 445-5942-1-ND; RoHS: RoHS Compliant; Stock 1: 106926; Pricing 1: 1=0.27, 10=0.18, 100=0.072, 250=0.05176, 500=0.0369, 1000=0.027 (USD); Tolerance: ±10%; Temperature Coefficient: X5R; Mounting Type: Surface Mount, MLCC; Applications: General Purpose; Ratings: -; Size / Dimension: 0.039" L x 0.020" W (1.00mm x 0.50mm); Height - Seated (Max): -; Thickness (Max): 0.022" (0.55mm); Lead Spacing: -; Features: -; Packaging: Cut Tape (CT); Lead Style: -; ComponentLink1URL: http://www.tdk.co.jp/tefe02/e412_c.pdf; ComponentLink1Description: http://www.tdk.co.jp/tefe02/e412_c.pdf
C33 C34 = C1005C0G1H180J: as C1 on sheet cpu; Capacitance: 18pF; Category: Capacitors; Supplier Part Number: 445-1238-1-ND; Manufacturer Part Number: C1005C0G1H180J; Operating Temperature: -55°C ~ 125°C; Package / Case: 0402 (1005 Metric); Price 1k [$]: 0.00468; Value: 18pF; .Checked SCH: used; Voltage - Rated: 50V; Supplier: Digikey; Supplier 1: Digi-Key; Supplier Part Number 1: 445-1238-1-ND; RoHS: RoHS Compliant; Stock 1: 24321; Pricing 1: 1=0.08, 10=0.05, 100=0.018, 250=0.013, 500=0.0096, 1000=0.0065 (USD); Tolerance: ±5%; Mounting Type: Surface Mount, MLCC; Applications: General Purpose; Ratings: -; Size / Dimension: 0.039" L x 0.020" W (1.00mm x 0.50mm); Height - Seated (Max): -; Thickness (Max): 0.022" (0.55mm); Lead Spacing: -; Features: -; Packaging: Cut Tape (CT); Lead Style: -; ComponentLink1URL: http://www.tdk.co.jp/tefe02/e412_c.pdf; ComponentLink1Description: http://www.tdk.co.jp/tefe02/e412_c.pdf
C35 = GRM155R71H271KA01D: CAP CER 270PF 50V 10% X7R 0402; Manufacturer: Murata Electronics North America; .Checked PCB: RF; Supplier 1: Digi-Key; Supplier Part Number 1: 490-1299-1-ND; Manufacturer Part Number: GRM155R71H271KA01D; RoHS: RoHS Compliant; Category: Capacitors; Stock 1: 83894; Pricing 1: 10=0.032, 50=0.0252, 100=0.0189, 250=0.01364, 500=0.01008, 1000=0.00683, 5000=0.00525 (USD); Capacitance: 270pF; Voltage - Rated: 50V; Tolerance: ±10%; Temperature Coefficient: X7R; Mounting Type: Surface Mount, MLCC; Operating Temperature: -55°C ~ 125°C; Applications: General Purpose; Ratings: -; Package / Case: 0402 (1005 Metric); Size / Dimension: 0.039" L x 0.020" W (1.00mm x 0.50mm); Height - Seated (Max): -; Thickness (Max): 0.022" (0.55mm); Lead Spacing: -; Features: -; Packaging: Cut Tape (CT); Lead Style: -; ComponentLink1URL: http://search.murata.co.jp/Ceramy/image/img/PDF/ENG/GRM155R71H271KA01.pdf; ComponentLink1Description: http://search.murata.co.jp/Ceramy/image/img/PDF/ENG/GRM155R71H271KA01.pdf; .Checked SCH: RF
C36 = C1005X5R1C105K: CAP CER 1.0UF 16V X5R 0402; Manufacturer: TDK Corporation; Capacitance: 1.0µF; Value: 1uF; .Checked PCB: used; Tolerance: ±10%; Category: Capacitors; Manufacturer Part Number: C1005X5R1C105K; Operating Temperature: -55°C ~ 85°C; Package / Case: 0402 (1005 Metric); Price 1k [$]: 0.02080; .Checked SCH: used; Voltage - Rated: 16V; Supplier Part Number: 445-4978-1-ND; Supplier: Digikey; Supplier 1: Digi-Key; Supplier Part Number 1: 445-4978-1-ND; RoHS: RoHS Compliant; Stock 1: 341010; Pricing 1: 1=0.24, 10=0.16, 100=0.064, 250=0.046, 500=0.0328, 1000=0.024 (USD); Temperature Coefficient: X5R; Mounting Type: Surface Mount, MLCC; Applications: General Purpose; Ratings: -; Size / Dimension: 0.039" L x 0.020" W (1.00mm x 0.50mm); Height - Seated (Max): -; Thickness (Max): 0.022" (0.55mm); Lead Spacing: -; Features: -; Packaging: Cut Tape (CT); Lead Style: -; ComponentLink1URL: http://www.tdk.co.jp/tefe02/e412_c.pdf; ComponentLink1Description: http://www.tdk.co.jp/tefe02/e412_c.pdf
C39 C41 = GRM31CR6YA106KA12L: CAP CER 10UF 35V X5R 1206; Manufacturer: Murata Electronics North America; Capacitance: 10µF; .Checked PCB: used; Tolerance: ±10%; Category: Capacitors; Manufacturer Part Number: GRM31CR6YA106KA12L; Operating Temperature: -55°C ~ 85°C; Package / Case: 1206 (3216 Metric); Price 1k [$]: 0.19448; Value: 10uF; .Checked SCH: used; Supplier Part Number: 490-5524-1-ND; Supplier: Digikey; Supplier 1: Digi-Key; Supplier Part Number 1: 490-5524-1-ND; RoHS: RoHS Compliant; Stock 1: 76334; Pricing 1: 1=0.6, 10=0.501, 50=0.359, 100=0.3142, 250=0.24684, 500=0.2244, 1000=0.17952 (USD); Temperature Coefficient: X5R; Mounting Type: Surface Mount, MLCC; Applications: General Purpose; Ratings: -; Size / Dimension: 0.126" L x 0.063" W (3.20mm x 1.60mm); Height - Seated (Max): -; Thickness (Max): 0.071" (1.80mm); Lead Spacing: -; Features: -; Packaging: Cut Tape (CT); Lead Style: -; ComponentLink1URL: http://www.murata.com/products/catalog/pdf/c02e.pdf; ComponentLink1Description: http://www.murata.com/products/catalog/pdf/c02e.pdf
J1 = HR911105A: DIP RJ45 Connector;; Manufacturer: HanRun; DISIGNER: ARMAN ARVAND; Manufacturer Part Number: HR911105A; Supplier Part Number 1: Abacus Technologies - HR911105A
L2 = MPZ1608S601A: FERRITE CHIP BEAD 600 OHM SMD 1A; Manufacturer: TDK Corporation; Impedance @ Frequency: 600 Ohm @ 100MHz; DC Resistance (DCR): 150 mOhm Max; Filter Type: Differential Mode - Single; Number of Lines: 1; .Checked PCB: RF; Supplier 1: Digi-Key; Supplier Part Number 1: 445-2205-1-ND; Manufacturer Part Number: MPZ1608S601A; RoHS: RoHS Compliant; Category: Filters; Stock 1: 328345; Pricing 1: 1=0.36, 10=0.24, 100=0.096, 250=0.069, 500=0.0492, 1000=0.036 (USD); Current Rating: 1A; Package / Case: 0603 (1608 Metric); Mounting Type: Surface Mount; Packaging: Cut Tape (CT); Height (Max): 0.037" (0.95mm); Size / Dimension: 0.063" L x 0.031" W (1.60mm x 0.80mm); ComponentLink1URL: http://www.tdk.co.jp/tefe02/e9413_mpz.pdf; ComponentLink1Description: http://www.tdk.co.jp/tefe02/e9413_mpz.pdf; .Checked SCH: RF
R13-R17 R24 R25 R28-R30 = RC0402FR-0710KL: as R6 on sheet cpu; Category: Resistors; Supplier Part Number: 311-10.0KLRCT-ND; Manufacturer Part Number: RC0402FR-0710KL; Package / Case: 0402 (1005 Metric); Price 1k [$]: 0.01421; Tolerance: ±1%; .Checked SCH: used; Supplier: Digikey; Supplier 1: Digi-Key; Supplier Part Number 1: 311-10.0KLRCT-ND; RoHS: RoHS Compliant; Stock 1: 2916495; Pricing 1: 10=0.014, 50=0.0104, 100=0.0079, 250=0.00584, 500=0.00432, 1000=0.00288 (USD); Composition: Thick Film; Features: -; Size / Dimension: 0.039" L x 0.020" W (1.00mm x 0.50mm); Height: 0.016" (0.40mm); Number of Terminations: 2; Packaging: Cut Tape (CT); ComponentLink1URL: http://www.yageo.com/documents/recent/PYu-RC0402_51_RoHS_L_6.pdf; ComponentLink1Description: http://www.yageo.com/documents/recent/PYu-RC0402_51_RoHS_L_6.pdf
R18-R20 R23 R26 R27 = CRCW0402330RFKED: RES 330 OHM 1/16W 1% 0402 SMD; Manufacturer: Vishay Dale; Resistance (Ohms): 330; Power (Watts): 0.063W, 1/16W; Temperature Coefficient: ±100ppm/°C; .Checked PCB: RF; Supplier 1: Digi-Key; Supplier Part Number 1: 541-330LCT-ND; Manufacturer Part Number: CRCW0402330RFKED; RoHS: RoHS Compliant; Category: Resistors; Stock 1: 49303; Pricing 1: 10=0.083, 50=0.0444, 200=0.0255, 1000=0.0174 (USD); Composition: Thick Film; Features: -; Tolerance: ±1%; Package / Case: 0402 (1005 Metric); Size / Dimension: 0.039" L x 0.020" W (1.00mm x 0.50mm); Height: 0.016" (0.40mm); Number of Terminations: 2; Packaging: Cut Tape (CT); ComponentLink1URL: http://www.vishay.com/doc?20035; ComponentLink1Description: http://www.vishay.com/doc?20035; .Checked SCH: RF
R21 R22 = RC0402FR-0710KL: as R5 on sheet cpu; Category: Resistors; Supplier Part Number: 311-10.0KLRCT-ND; Manufacturer Part Number: RC0402FR-0710KL; Package / Case: 0402 (1005 Metric); Price 1k [$]: 0.01421; Resistance (Ohms): 10K; Tolerance: ±1%; Value: 10k; .Checked SCH: used; Supplier: Digikey; Supplier 1: Digi-Key; Supplier Part Number 1: 311-10.0KLRCT-ND; RoHS: RoHS Compliant; Stock 1: 2916495; Pricing 1: 10=0.014, 50=0.0104, 100=0.0079, 250=0.00584, 500=0.00432, 1000=0.00288 (USD); Composition: Thick Film; Features: -; Size / Dimension: 0.039" L x 0.020" W (1.00mm x 0.50mm); Height: 0.016" (0.40mm); Number of Terminations: 2; Packaging: Cut Tape (CT); ComponentLink1URL: http://www.yageo.com/documents/recent/PYu-RC0402_51_RoHS_L_6.pdf; ComponentLink1Description: http://www.yageo.com/documents/recent/PYu-RC0402_51_RoHS_L_6.pdf
U2 = LAN8742A-CZ-TR: Integrated Circuit; Manufacturer_Name: Microchip; Datasheet Link: http://ww1.microchip.com/downloads/en/DeviceDoc/8742a.pdf; Height: 1mm; Manufacturer_Part_Number: LAN8742A-CZ-TR; Mouser Part Number: 579-LAN8742A-CZ-TR; Mouser Price/Stock: https://www.mouser.com/Search/Refine.aspx?Keyword=579-LAN8742A-CZ-TR
Y3 = CMP-1695-00001-3: as Y2 on sheet cpu; ComponentLink2Description: Datasheet; Mounting Technology: Surface Mount; PackageDescription: 4-Pin Surface Mount Device, Body 1.6 x 2 mm, Pitch 1.45 mm; ComponentLink1URL: https://www.eea.epson.com/; DatasheetVersion: Rev. Feb-15; ComponentLink2URL: https://support.epson.biz/td/api/doc_check.php?dl=brief_FA-128_en.pdf; ComponentLink1Description: Manufacturer URL; PartNumber: FA-128 25.0000MB-C

## Sheet SDRAM.SchDoc
size A
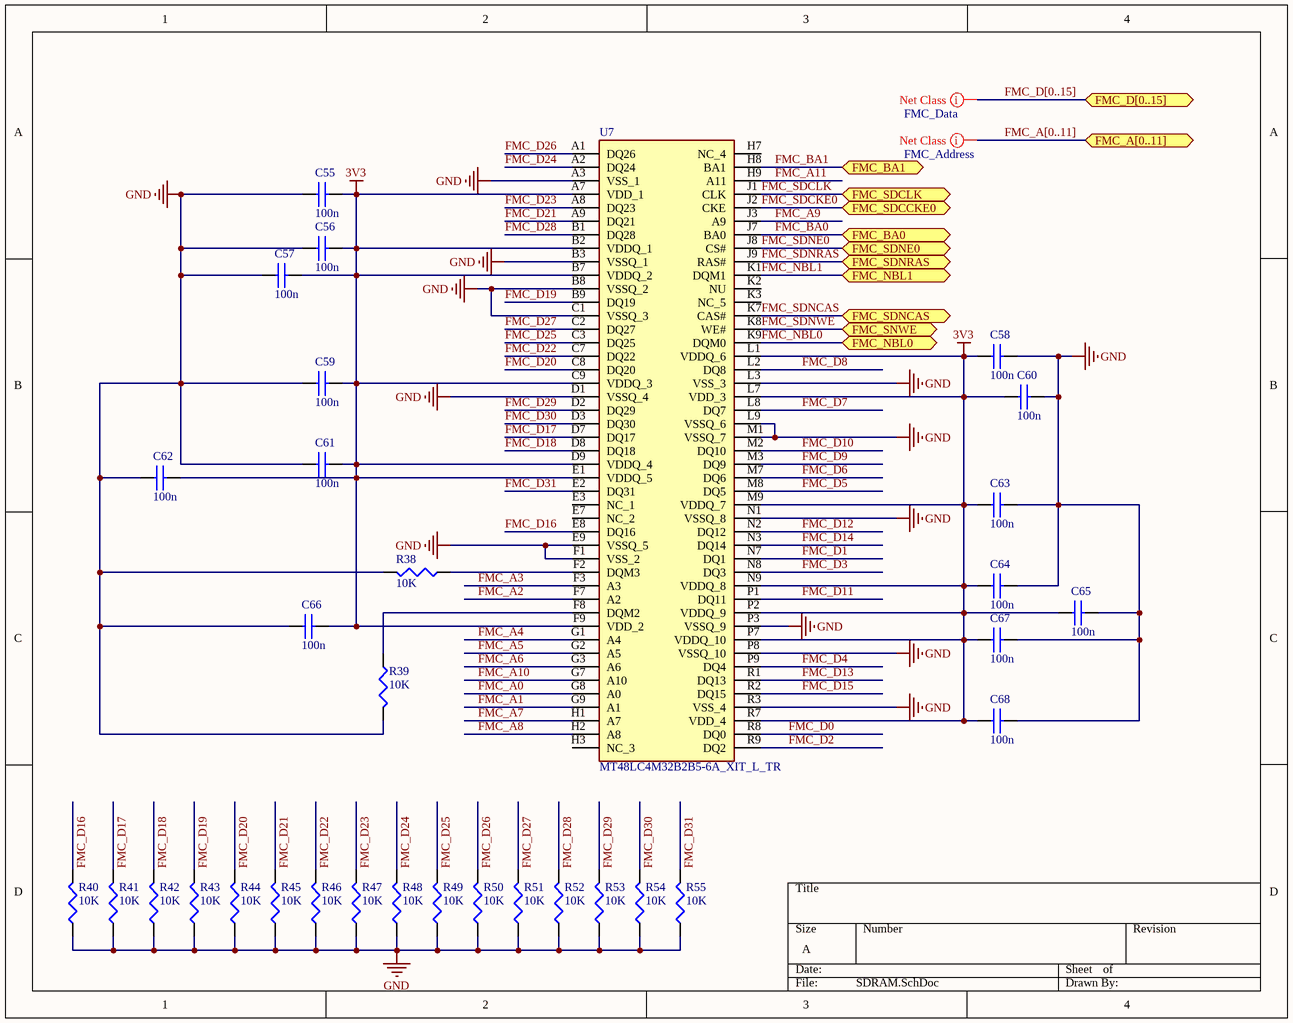
[diagram p4: SDRAM.SchDoc]

### Parts
C55  100n  [C0402]
C56  100n  [C0402]
C57  100n  [C0402]
C58  100n  [C0402]
C59  100n  [C0402]
C60  100n  [C0402]
C61  100n  [C0402]
C62  100n  [C0402]
C63  100n  [C0402]
C64  100n  [C0402]
C65  100n  [C0402]
C66  100n  [C0402]
C67  100n  [C0402]
C68  100n  [C0402]
R38  10K  [R0402]
R39  10K  [R0402]
R40  10K  [R0402]
R41  10K  [R0402]
R42  10K  [R0402]
R43  10K  [R0402]
R44  10K  [R0402]
R45  10K  [R0402]
R46  10K  [R0402]
R47  10K  [R0402]
R48  10K  [R0402]
R49  10K  [R0402]
R50  10K  [R0402]
R51  10K  [R0402]
R52  10K  [R0402]
R53  10K  [R0402]
R54  10K  [R0402]
R55  10K  [R0402]
U7  MT48LC4M32B2B5-6A_XIT_L_TR  [BGA90C80P9X15_800X1300X70]

### Ports
FMC_A[0..11] (bidir), FMC_BA0 (bidir), FMC_BA1 (bidir), FMC_D[0..15] (bidir), FMC_NBL0 (bidir), FMC_NBL1 (bidir), FMC_SDCCKE0 (bidir), FMC_SDCLK (bidir), FMC_SDNCAS (bidir), FMC_SDNE0 (bidir), FMC_SDNRAS (bidir), FMC_SNWE (bidir)

### Nets
3V3: C55.2 C56.2 C57.2 C58.1 C59.2 C60.1 C61.2 C62.2 C63.1 C64.1 C65.1 C66.2 C67.1 C68.1 U7.A7(VDD_1) U7.B2(VDDQ_1) U7.B7(VDDQ_2) U7.C9(VDDQ_3) U7.D9(VDDQ_4) U7.E1(VDDQ_5) U7.F9(VDD_2) U7.L1(VDDQ_6) U7.L7(VDD_3) U7.M9(VDDQ_7) U7.N9(VDDQ_8) U7.P2(VDDQ_9) U7.P7(VDDQ_10) U7.R7(VDD_4)
GND: C55.1 C56.1 C57.1 C58.2 C59.1 C60.2 C61.1 C62.1 C63.2 C64.2 C65.2 C66.1 C67.2 C68.2 R38.2 R39.2 R40.1 R41.1 R42.1 R43.1 R44.1 R45.1 R46.1 R47.1 R48.1 R49.1 R50.1 R51.1 R52.1 R53.1 R54.1 R55.1 U7.A3(VSS_1) U7.B3(VSSQ_1) U7.B8(VSSQ_2) U7.C1(VSSQ_3) U7.D1(VSSQ_4) U7.E9(VSSQ_5) U7.F1(VSS_2) U7.L3(VSS_3) U7.L9(VSSQ_6) U7.M1(VSSQ_7) U7.N1(VSSQ_8) U7.P3(VSSQ_9) U7.P8(VSSQ_10) U7.R3(VSS_4)
FMC_A0: U7.G8(A0)
FMC_A1: U7.G9(A1)
FMC_A2: U7.F7(A2)
FMC_A3: U7.F3(A3)
FMC_A4: U7.G1(A4)
FMC_A5: U7.G2(A5)
FMC_A6: U7.G3(A6)
FMC_A7: U7.H1(A7)
FMC_A8: U7.H2(A8)
FMC_A9: U7.J3(A9)
FMC_A10: U7.G7(A10)
FMC_A11: U7.H9(A11)
FMC_BA0: U7.J7(BA0) ; port FMC_BA0
FMC_BA1: U7.H8(BA1) ; port FMC_BA1
FMC_D0: U7.R8(DQ0)
FMC_D1: U7.N7(DQ1)
FMC_D2: U7.R9(DQ2)
FMC_D3: U7.N8(DQ3)
FMC_D4: U7.P9(DQ4)
FMC_D5: U7.M8(DQ5)
FMC_D6: U7.M7(DQ6)
FMC_D7: U7.L8(DQ7)
FMC_D8: U7.L2(DQ8)
FMC_D9: U7.M3(DQ9)
FMC_D10: U7.M2(DQ10)
FMC_D11: U7.P1(DQ11)
FMC_D12: U7.N2(DQ12)
FMC_D13: U7.R1(DQ13)
FMC_D14: U7.N3(DQ14)
FMC_D15: U7.R2(DQ15)
FMC_D16: R40.2 U7.E8(DQ16)
FMC_D17: R41.2 U7.D7(DQ17)
FMC_D18: R42.2 U7.D8(DQ18)
FMC_D19: R43.2 U7.B9(DQ19)
FMC_D20: R44.2 U7.C8(DQ20)
FMC_D21: R45.2 U7.A9(DQ21)
FMC_D22: R46.2 U7.C7(DQ22)
FMC_D23: R47.2 U7.A8(DQ23)
FMC_D24: R48.2 U7.A2(DQ24)
FMC_D25: R49.2 U7.C3(DQ25)
FMC_D26: R50.2 U7.A1(DQ26)
FMC_D27: R51.2 U7.C2(DQ27)
FMC_D28: R52.2 U7.B1(DQ28)
FMC_D29: R53.2 U7.D2(DQ29)
FMC_D30: R54.2 U7.D3(DQ30)
FMC_D31: R55.2 U7.E2(DQ31)
FMC_NBL0: U7.K9(DQM0) ; port FMC_NBL0
FMC_NBL1: U7.K1(DQM1) ; port FMC_NBL1
FMC_SDCKE0: U7.J2(CKE) ; port FMC_SDCCKE0
FMC_SDCLK: U7.J1(CLK) ; port FMC_SDCLK
FMC_SDNCAS: U7.K7(CAS#) ; port FMC_SDNCAS
FMC_SDNE0: U7.J8(CS#) ; port FMC_SDNE0
FMC_SDNRAS: U7.J9(RAS#) ; port FMC_SDNRAS
FMC_SDNWE: U7.K8(WE#) ; port FMC_SNWE
NetR38_1: R38.1 U7.F2(DQM3)
NetR39_1: R39.1 U7.F8(DQM2)

Not connected (* = marked no-connect by the designer): U7 E3(NC_1) E7(NC_2) H3(NC_3) H7(NC_4) K2(NU) K3(NC_5)

### Buses and harness runs
bus FMC_A[0..11] = port FMC_A[0..11]
bus FMC_D[0..15] = port FMC_D[0..15]

### Layout directives
net class FMC_Data: (no net found under the mark)
net class FMC_Address: (no net found under the mark)

### Library data of the parts
C55-C68 = C1005X5R1H104K: as C50 on sheet ps; Category: Capacitors; Supplier Part Number: 445-5942-1-ND; Manufacturer Part Number: C1005X5R1H104K; Operating Temperature: -55°C ~ 85°C; Package / Case: 0402 (1005 Metric); Price 1k [$]: 0.02340; .Checked SCH: used; Voltage - Rated: 50V; Supplier: Digikey; Supplier 1: Digi-Key; Supplier Part Number 1: 445-5942-1-ND; RoHS: RoHS Compliant; Stock 1: 106926; Pricing 1: 1=0.27, 10=0.18, 100=0.072, 250=0.05176, 500=0.0369, 1000=0.027 (USD); Tolerance: ±10%; Temperature Coefficient: X5R; Mounting Type: Surface Mount, MLCC; Applications: General Purpose; Ratings: -; Size / Dimension: 0.039" L x 0.020" W (1.00mm x 0.50mm); Height - Seated (Max): -; Thickness (Max): 0.022" (0.55mm); Lead Spacing: -; Features: -; Packaging: Cut Tape (CT); Lead Style: -; ComponentLink1URL: http://www.tdk.co.jp/tefe02/e412_c.pdf; ComponentLink1Description: http://www.tdk.co.jp/tefe02/e412_c.pdf
R38-R55 = RC0402FR-0710KL: as R5 on sheet cpu; Category: Resistors; Supplier Part Number: 311-10.0KLRCT-ND; Manufacturer Part Number: RC0402FR-0710KL; Package / Case: 0402 (1005 Metric); Price 1k [$]: 0.01421; Resistance (Ohms): 10K; Tolerance: ±1%; Value: 10k; .Checked SCH: used; Supplier: Digikey; Supplier 1: Digi-Key; Supplier Part Number 1: 311-10.0KLRCT-ND; RoHS: RoHS Compliant; Stock 1: 2916495; Pricing 1: 10=0.014, 50=0.0104, 100=0.0079, 250=0.00584, 500=0.00432, 1000=0.00288 (USD); Composition: Thick Film; Features: -; Size / Dimension: 0.039" L x 0.020" W (1.00mm x 0.50mm); Height: 0.016" (0.40mm); Number of Terminations: 2; Packaging: Cut Tape (CT); ComponentLink1URL: http://www.yageo.com/documents/recent/PYu-RC0402_51_RoHS_L_6.pdf; ComponentLink1Description: http://www.yageo.com/documents/recent/PYu-RC0402_51_RoHS_L_6.pdf
U7 = MT48LC4M32B2B5-6A_XIT_L_TR: Integrated Circuit; Manufacturer_Name: Micron; Manufacturer_Part_Number: MT48LC4M32B2B5-6A XIT:L TR; Datasheet Link: http://www.micron.com/~/media/Documents/Products/Data%20Sheet/DRAM/128mb_x32_sdram.pdf; Height: 0.7mm; Mouser Part Number: 340-140098-REEL; Mouser Price/Stock: https://www.mouser.com/Search/Refine.aspx?Keyword=340-140098-REEL